# EAGLE design SprinklerControllerRecover (EAGLE 6.3)
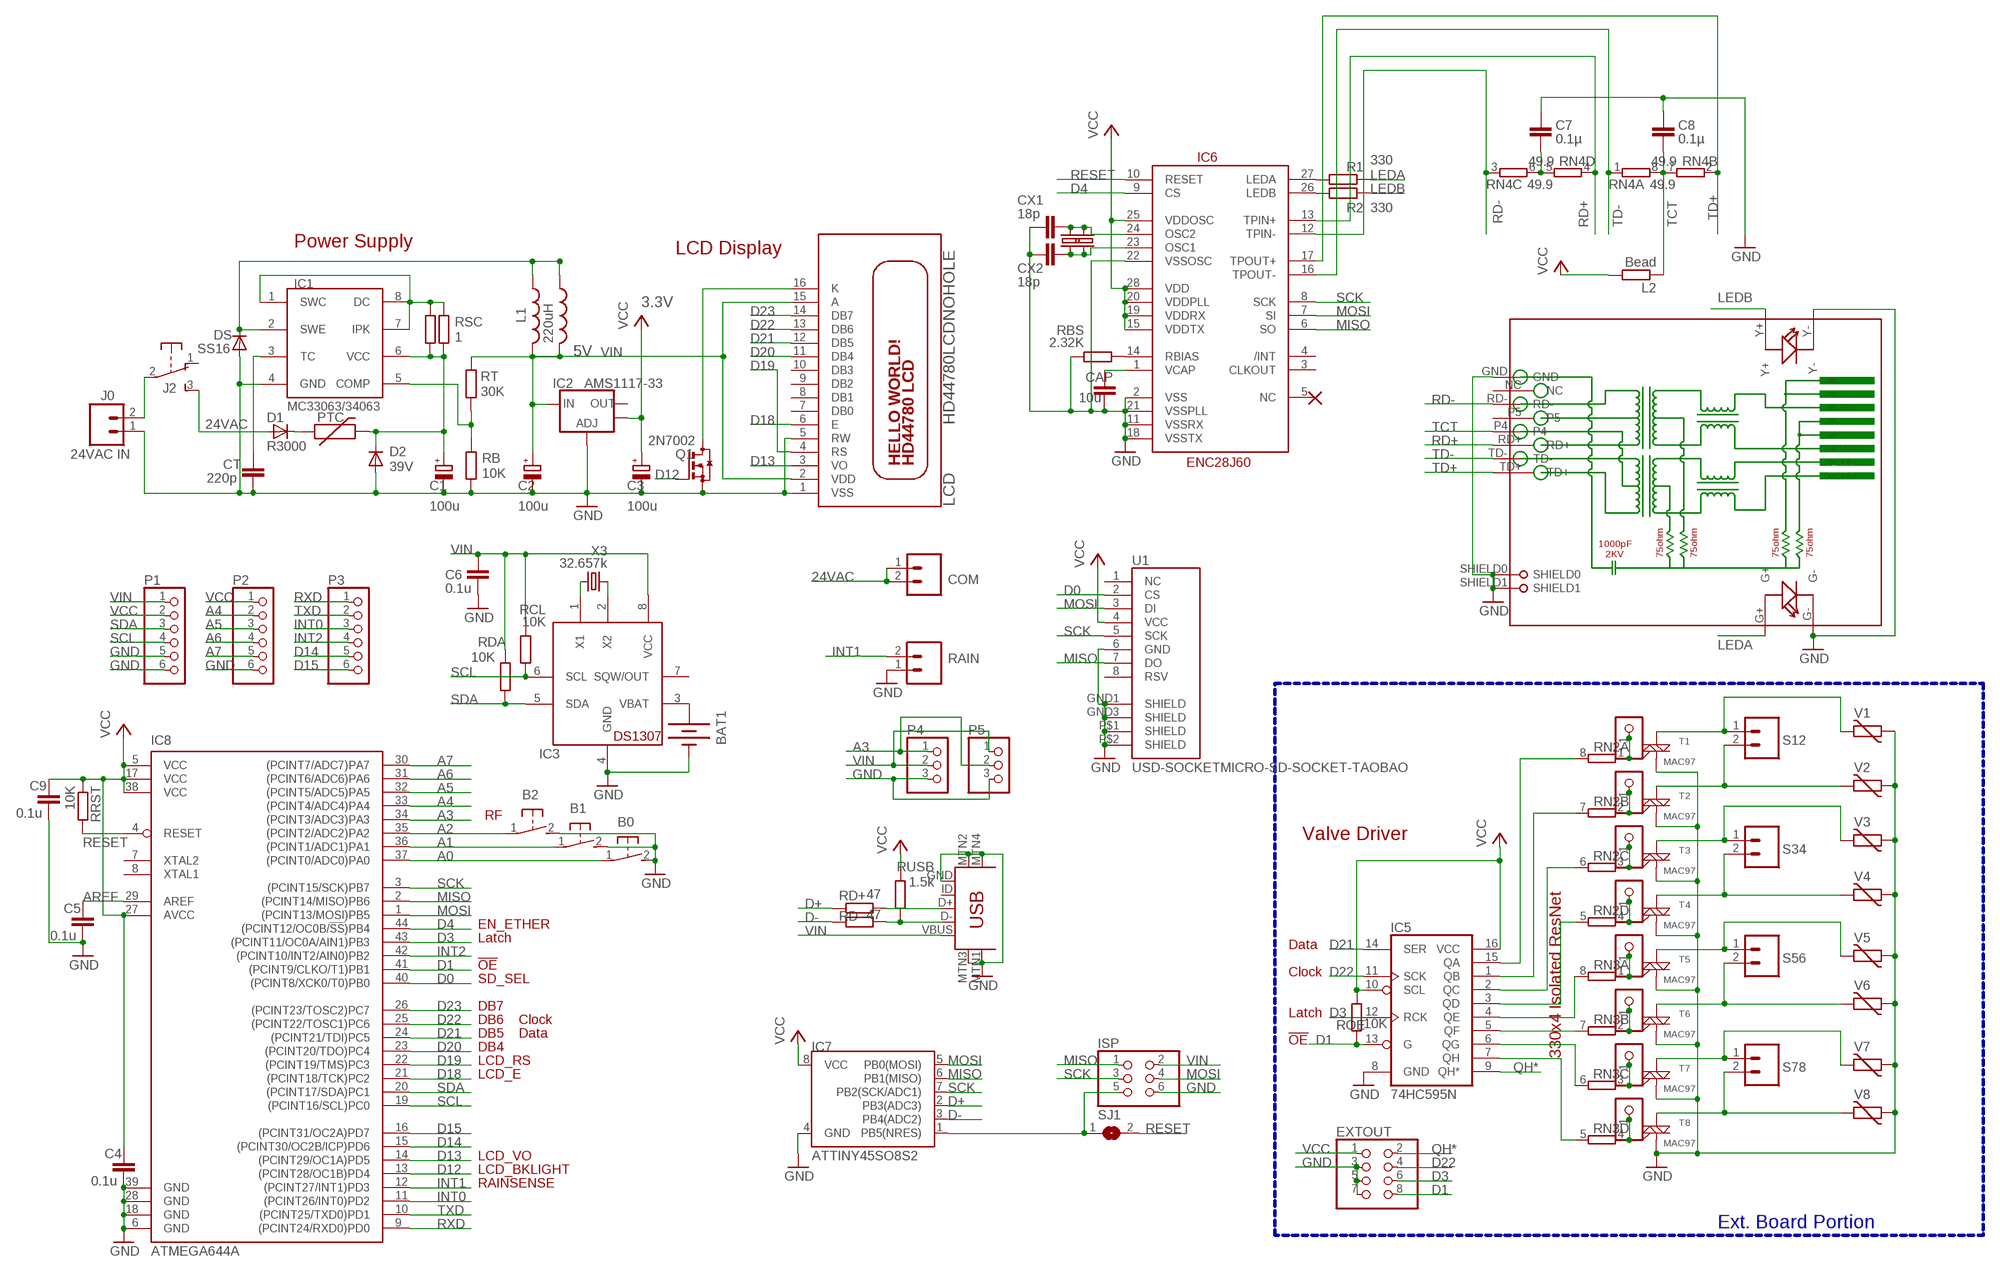
[diagram p0: schematic, sheet 1]

## Parts
B0  31-XX  [B3F-31XX]
B1  31-XX  [B3F-31XX]
B2  31-XX  [B3F-31XX]
BAT1  BATTERYBATTERY_12MM_SMT  [BATTCON_12MM_SMT]
C1  100u  CPOL-EUE3.5-8  [E3,5-8]
C2  100u  CPOL-EUE2.5-5  [E2,5-5]
C3  100u  CPOL-EUE2.5-5  [E2,5-5]
C4  0.1u  C-EUC0805  [C0805]
C5  0.1u  C-EUC0805  [C0805]
C6  0.1u  C-EUC0805  [C0805]
C7  0.1µ  C-EUC0805  [C0805]
C8  0.1µ  C-EUC0805  [C0805]
C9  0.1u  C-EUC0805  [C0805]
CAP  10u  C-EUC0805  [C0805]
COM  M025MM  [SCREWTERMINAL-5MM-2]
CT  220p  C-EUC0805  [C0805]
CX1  18p  C-EUC0805  [C0805]
CX2  18p  C-EUC0805  [C0805]
D1  R3000  DIODE-DO41-7.6  [DO41-7.6]
D2  39V  DIODE-DO41-7.6  [DO41-7.6]
DS  SS16  DIODE-DO214AC  [DO214AC]
EXTOUT  PINHD-2X4  [2X04]
IC1  MC34063  MC33063/MC34063D  [SO08]
IC2  AMS1117-33  V_REG_LM1117SOT223  [SOT223]
IC3  DS1307  DS1307SOIC  [SO08]
IC5  74HC595N  74LS595D  [SO16]
IC6  ENC28J60  ENC28J60SO28LONG  [SOIC28WLONG]
IC7  ATTINY45SO8S2  [SO8S2]
IC8  ATMEGA644A  [TQFP44]
ISP  PINHD-2X3  [2X03]
J0  24VAC IN  M025MM  [SCREWTERMINAL-5MM-2]
J2  EG1206  [EG1206]
JP2  PINHD-1X1CB  [1X01-CLEANBIG]
JP3  PINHD-1X1CB  [1X01-CLEANBIG]
JP4  PINHD-1X1CB  [1X01-CLEANBIG]
JP5  PINHD-1X1CB  [1X01-CLEANBIG]
JP6  PINHD-1X1CB  [1X01-CLEANBIG]
JP7  PINHD-1X1CB  [1X01-CLEANBIG]
JP8  PINHD-1X1CB  [1X01-CLEANBIG]
JP9  PINHD-1X1CB  [1X01-CLEANBIG]
L1  220uH  L-US6000-XXX-RC  [6000-XXXX-RC]
L2  Bead  R-EU_R0805  [R0805]
L3  220uH  INDUCTORSRU1038  [SRU1038]
LCD  HD44780LCDNOHOLE  [LCD1602A]
P1  PINHD-1X6CLEAN  [1X06-CLEAN]
P2  PINHD-1X6CLEAN  [1X06-CLEAN]
P3  PINHD-1X6CLEAN  [1X06-CLEAN]
P4  PINHD-1X3  [1X03]
P5  PINHD-1X3  [1X03]
PTC  PTC  PTCPTH  [PTC]
Q1  2N7002  BSS123  [SOT23]
R1  330  R-EU_R0805  [R0805]
R2  330  R-EU_R0805  [R0805]
RAIN  M025MM  [SCREWTERMINAL-5MM-2]
RB  10K  R-EU_R0805  [R0805]
RBS  2.32K  R-EU_R0805  [R0805]
RCL  10K  R-EU_R0805  [R0805]
RD+  47  R-EU_R0805  [R0805]
RD-  47  R-EU_R0805  [R0805]
RDA  10K  R-EU_R0805  [R0805]
RJ1  HR911105A  [HR911105A]
RN2  4R-NEXB38V  [EXB38V]
RN3  4R-NEXB38V  [EXB38V]
RN4  49.9  4R-NEXB38V  [EXB38V]
ROE  10K  R-EU_R0805  [R0805]
RRST  10K  R-EU_R0805  [R0805]
RSC  1  R-EU_R0805  [R0805]
RSC1  1.0  R-EU_R0805  [R0805]
RT  30K  R-EU_R0805  [R0805]
RUSB  1.5k  R-EU_R0805  [R0805]
S12  M025MM  [SCREWTERMINAL-5MM-2]
S34  M025MM  [SCREWTERMINAL-5MM-2]
S56  M025MM  [SCREWTERMINAL-5MM-2]
S78  M025MM  [SCREWTERMINAL-5MM-2]
SJ1  SJ  [SJ]
T1  MAC97  MAC97SOT223  [SOT223]
T2  MAC97  MAC97SOT223  [SOT223]
T3  MAC97  MAC97SOT223  [SOT223]
T4  MAC97  MAC97SOT223  [SOT223]
T5  MAC97  MAC97SOT223  [SOT223]
T6  MAC97  MAC97SOT223  [SOT223]
T7  MAC97  MAC97SOT223  [SOT223]
T8  MAC97  MAC97SOT223  [SOT223]
U1  USD-SOCKETMICRO-SD-SOCKET-TAOBAO  [MICRO-SD-SOCKET-TAOBAO]
U$1  USB-MINIB-5PIN  [USB-MINIB]
V1  MOV  VARISTOR-5  [R-5]
V2  MOV  VARISTOR-5  [R-5]
V3  MOV  VARISTOR-5  [R-5]
V4  MOV  VARISTOR-5  [R-5]
V5  MOV  VARISTOR-5  [R-5]
V6  MOV  VARISTOR-5  [R-5]
V7  MOV  VARISTOR-5  [R-5]
V8  MOV  VARISTOR-5  [R-5]
X2A  25MHz  CRYSTAL10.5X4.8  [CRYSTAL-SMD-10.5X4.8-2PIN]
X2A1  25MHz  CRYSTALHC49US  [HC49US]
X3  32.657k  CRYSTALTC26H  [TC26H]

## Nets
24VAC [power]: COM.1 COM.2 D1.A J2.3(S)
A0: B0.1(P) IC8.37((PCINT0/ADC0)PA0)
A1: B1.1(P) IC8.36((PCINT1/ADC1)PA1)
A2: B2.1(P) IC8.35((PCINT2/ADC2)PA2)
A3: IC8.34((PCINT3/ADC3)PA3) P4.1 P5.2
A4: IC8.33((PCINT4/ADC4)PA4) P2.2
A5: IC8.32((PCINT5/ADC5)PA5) P2.3
A6: IC8.31((PCINT6/ADC6)PA6) P2.4
A7: IC8.30((PCINT7/ADC7)PA7) P2.5
AREF: C5.1 IC8.29(AREF)
D0: IC8.40((PCINT8/XCK0/T0)PB0) U1.2(CS)
D1: EXTOUT.8 IC5.13(G) IC8.41((PCINT9/CLKO/T1)PB1) ROE.1
D3: EXTOUT.6 IC5.12(RCK) IC8.43((PCINT11/OC0A/AIN1)PB3)
D4: IC6.9(CS) IC8.44((PCINT12/OC0B/!SS!)PB4)
D12: IC8.13((PCINT28/OC1B)PD4) Q1.1(G)
D13: IC8.14((PCINT29/OC1A)PD5) LCD.3(VO)
D14: IC8.15((PCINT30/OC2B/ICP)PD6) P3.5
D15: IC8.16((PCINT31/OC2A)PD7) P3.6
D18: IC8.21((PCINT18/TCK)PC2) LCD.6(E)
D19: IC8.22((PCINT19/TMS)PC3) LCD.4(RS)
D20: IC8.23((PCINT20/TDO)PC4) LCD.11(DB4)
D21: IC5.14(SER) IC8.24((PCINT21/TDI)PC5) LCD.12(DB5)
D22: EXTOUT.4 IC5.11(SCK) IC8.25((PCINT22/TOSC1)PC6) LCD.13(DB6)
D23: IC8.26((PCINT23/TOSC2)PC7) LCD.14(DB7)
D+: IC7.2(PB3(ADC3)) RD+.1
D-: IC7.3(PB4(ADC2)) RD-.1
GND: B0.2(S) B1.2(S) B2.2(S) BAT1.P$1(-) C1.- C2.- C3.- C4.2 C5.2 C6.2 C7.1 C8.1 C9.2 CAP.2 CT.2 CX1.2 CX2.2 D2.A DS.A EXTOUT.3 EXTOUT.5 EXTOUT.7 IC1.4(GND) IC2.1(ADJ) IC3.4(GND) IC5.8(GND) IC6.2(VSS) IC6.11(VSSRX) IC6.18(VSSTX) IC6.21(VSSPLL) IC6.22(VSSOSC) IC7.4(GND) IC8.6(GND) IC8.18(GND) IC8.28(GND) IC8.39(GND) ISP.6 J0.1 LCD.1(VSS) LCD.5(RW) P1.5 P1.6 P2.6 P4.3 P5.3 Q1.2(S) RAIN.1 RB.2 RBS.1 RJ1.G- RJ1.GND RJ1.SHIELD0 RJ1.SHIELD1 RJ1.Y- T1.1(M1) T2.1(M1) T3.1(M1) T4.1(M1) T5.1(M1) T6.1(M1) T7.1(M1) T8.1(M1) U1.6(GND) U1.GND1(SHIELD) U1.GND3(SHIELD) U1.P$1(SHIELD) U1.P$2(SHIELD) U$1.GND U$1.MTN1(MTN2) U$1.MTN2(MTN3) U$1.MTN3(MTN1) U$1.MTN4 V1.1 V2.1 V3.1 V4.1 V5.1 V6.1 V7.1 V8.1
INT0: IC8.11((PCINT26/INT0)PD2) P3.3
INT1: IC8.12((PCINT27/INT1)PD3) RAIN.2
INT2: IC8.42((PCINT10/INT2/AIN0)PB2) P3.4
LEDA: R1.2 RJ1.G+
LEDB: R2.2 RJ1.Y+
MISO: IC6.6(SO) IC7.6(PB1(MISO)) IC8.2((PCINT14/MISO)PB6) ISP.1 U1.7(DO)
MOSI: IC6.7(SI) IC7.5(PB0(MOSI)) IC8.1((PCINT13/MOSI)PB5) ISP.4 U1.3(DI)
N$1: D1.C PTC.P$1
N$3: JP2.1 RN2.1 T1.3(G)
N$4: IC5.5(QF) RN3.7
N$5: IC5.6(QG) RN3.6
N$6 [power]: J0.2 J2.2(P)
N$7: IC5.7(QH) RN3.5
N$8 [power]: C1.+ D2.C IC1.6(VCC) PTC.P$2 RSC1.2 RSC.2
N$10: IC5.4(QE) RN3.8
N$11: IC5.3(QD) RN2.5
N$12: IC5.2(QC) RN2.6
N$13: IC5.1(QB) RN2.7
N$14: IC5.15(QA) RN2.8
N$15: JP3.1 RN2.2 T2.3(G)
N$16 [power]: S12.1 T1.4(M2) V1.2
N$17 [power]: S12.2 T2.4(M2) V2.2
N$18 [power]: S34.1 T3.4(M2) V3.2
N$19: JP4.1 RN2.3 T3.3(G)
N$20 [power]: S34.2 T4.4(M2) V4.2
N$21: JP5.1 RN2.4 T4.3(G)
N$22 [power]: S56.1 T5.4(M2) V5.2
N$23 [power]: S56.2 T6.4(M2) V6.2
N$24 [power]: S78.1 T7.4(M2) V7.2
N$25 [power]: S78.2 T8.4(M2) V8.2
N$26: JP6.1 RN3.1 T5.3(G)
N$27: JP7.1 RN3.2 T6.3(G)
N$28: JP8.1 RN3.3 T7.3(G)
N$29: JP9.1 RN3.4 T8.3(G)
N$34: IC6.27(LEDA) R1.1
N$36: BAT1.P$2(+) IC3.3(VBAT)
N$37: IC6.26(LEDB) R2.1
N$38: RD+.2 U$1.D+
N$39: CAP.1 IC6.1(VCAP)
N$40 [power]: IC1.1(SWC) IC1.7(IPK) IC1.8(DC) RSC1.1 RSC.1
N$41: CX1.1 IC6.24(OSC2) X2A1.2 X2A.P$2
N$42: CX2.1 IC6.23(OSC1) X2A1.1 X2A.P$1
N$45: RD-.2 RUSB.1 U$1.D-
N$46 [power]: DS.C IC1.2(SWE) L1.1 L3.1
N$47: IC3.1(X1) X3.1
N$49: CT.1 IC1.3(TC)
N$50: IC3.2(X2) X3.2
N$52: IC7.1(PB5(NRES)) ISP.5 SJ1.1
N$54: C7.2 RN4.5 RN4.6
N$55: IC1.5(COMP) RB.1 RT.2
N$56: LCD.16(K) Q1.3(D)
N$59: IC6.14(RBIAS) RBS.2
QH*: EXTOUT.2 IC5.9(QH*)
RD+: IC6.13(TPIN+) RJ1.RD+ RN4.4
RD-: IC6.12(TPIN-) RJ1.RD- RN4.3
RESET: IC6.10(RESET) IC8.4(RESET) RRST.2 SJ1.2
RXD: IC8.9((PCINT24/RXD0)PD0) P3.1
SCK: IC6.8(SCK) IC7.7(PB2(SCK/ADC1)) IC8.3((PCINT15/SCK)PB7) ISP.3 U1.5(SCK)
SCL: IC3.6(SCL) IC8.19((PCINT16/SCL)PC0) P1.4 RCL.2
SDA: IC3.5(SDA) IC8.20((PCINT17/SDA)PC1) P1.3 RDA.2
TCT: C8.2 L2.1 RJ1.P4 RN4.7 RN4.8
TD+: IC6.17(TPOUT+) RJ1.TD+ RN4.2
TD-: IC6.16(TPOUT-) RJ1.TD- RN4.1
TXD: IC8.10((PCINT25/TXD0)PD1) P3.2
VCC: C3.+ C4.1 C9.1 EXTOUT.1 IC2.4(OUT) IC5.10(SCL) IC5.16(VCC) IC6.15(VDDTX) IC6.19(VDDRX) IC6.20(VDDPLL) IC6.25(VDDOSC) IC6.28(VDD) IC7.8(VCC) IC8.5(VCC) IC8.17(VCC) IC8.27(AVCC) IC8.38(VCC) L2.2 P1.2 P2.1 ROE.2 RRST.1 RUSB.2 U1.4(VCC)
VIN: C2.+ C6.1 IC2.3(IN) IC3.8(VCC) ISP.2 L1.2 L3.2 LCD.2(VDD) LCD.15(A) P1.1 P4.2 P5.1 RCL.1 RDA.1 RT.1 U$1.VBUS
Unconnected: IC2.2(OUT) IC3.7(SQW/OUT) IC6.3(CLKOUT) IC6.4(/INT) IC6.5(NC) IC8.7(XTAL2) IC8.8(XTAL1) J2.1(O) LCD.7(DB0) LCD.8(DB1) LCD.9(DB2) LCD.10(DB3) RJ1.NC RJ1.P5 U1.1(NC) U1.8(RSV) U$1.ID

## Buses
B$1

## Notes on the sheet
- Power Supply
- LCD Display
- 3.3V
- 5V
- RF
- Valve Driver
- EN_ETHER
- Latch
- Data
- !OE
- Clock
- SD_SEL
- DB7
- Latch
- DB6 | Clock
- DB5 | Data
- !OE
- DB4
- 330x4 Isolated ResNet
- LCD_RS
- LCD_E
- LCD_VO
- LCD_BKLIGHT
- RAINSENSE
- Ext. Board Portion

## Library data of the parts
B0 B1 B2 = adafruit:31-XX: OMRON SWITCH Now with beefier pads!
BAT1 = SparkFunNew:BATTERY: Battery Holders Various common sizes : AA, AAA, 20mm coin cell and 12mm coin cell.
C1-C3 = resistor:CPOL-EU: POLARIZED CAPACITOR, European symbol
C4-C6 C9 CT = rcl:C-EU: CAPACITOR, European symbol
C7 C8 CAP CX1 CX2 = resistor:C-EU: CAPACITOR, European symbol
COM J0 RAIN S12 S34 S56 S78 = SparkFun:M02: Header 2 Standard 2-pin 0.1" header. Use with straight break away headers (SKU : PRT-00116), right angle break away headers (PRT-00553), swiss pins (PRT-00743), machine pins (PRT-00117), and female headers (PRT-00115). Molex polarized connector foot print use with SKU : PRT-08233 with associated crimp pins and housings.
D1 D2 DS = diode:DIODE-: DIODE
EXTOUT = pinhead:PINHD-2X4: PIN HEADER
IC1 = adafruit:MC33063/MC34063: MC33063 and MC34063 Basic DC/DC converter with internal power-NPN transistor, 100KHz, 1.5A peak switch current. 3-40 input/output.
IC2 = SparkFun:V_REG_LM1117: Voltage Regulator LM1117 Standard adjustable voltage regulator but in SMD form. Spark Fun Electronics SKU : COM-00595
IC3 = adafruit:DS1307: DS1307 Real time clock (RTC) with battery backup ability. Talk to it via i2c
IC5 = SparkFun:74*595: 8-bit SHIFT REGISTER, output latch
IC6 = SparkFun:ENC28J60
IC7 = SparkFun:ATTINY45: Atmel ATTiny45
IC8 = atmel:ATMEGA644: 8-bit Microcontroller with 64K Bytes In-System Programmable Flash Source: http://www.atmel.com/dyn/resources/prod_documents/doc2593.pdf; MPN: ATMEGA644PV-10AU; OC_FARNELL: 1455123; OC_NEWARK: 58M3748
ISP = pinhead:PINHD-2X3: PIN HEADER
J2 = adafruit:EG1206
JP2-JP9 = adafruit:PINHD-1X1: Pin header 1x1 for 0.1" spacing With round pins
L1 = rcl:L-US: INDUCTOR, American symbol
L2 R1 R2 RB RBS RCL RD+ RD- RDA ROE RRST RSC RSC1 RT RUSB = rcl:R-EU_: RESISTOR, European symbol
L3 = SparkFunNew:INDUCTOR: Inductors Basic Inductor/Choke - 0603 and 1206. Footprints are not proven and vary greatly between part numbers.
LCD = adafruit:HD44780LCD: HD44780 LCD Standard character type LCDs, available in sizes from 8x1 to 40x4!
P1-P3 = adafruit:PINHD-1X6: PIN HEADER
P4 P5 = pinhead:PINHD-1X3: PIN HEADER
PTC = SparkFunNew:PTC: Resettable Fuse PTC Resettable Fuse. Spark Fun Electronics SKU : COM-08357
Q1 = transistor-small-signal:BSS123: N-CHANNEL MOS FET
RJ1 = CONNECTER:HR911105A
RN2-RN4 = resistor-dil:4R-N: Array Chip Resistor Source: RS Component / Phycomp; OC_FARNELL: unknown; OC_NEWARK: unknown
SJ1 = jumper:SJ: SMD solder JUMPER
T1-T8 = SparkFun:MAC97: MAC97 Triac http://www.onsemi.com/pub_link/Collateral/MAC97-D.PDF
U1 = SparkFunNew:USD-SOCKET: microSD Socket Push-push type uSD socket. Schematic element and footprint production proven. Spark Fun Electronics SKU : PRT-00127. tDoc lines correctly indicate media card edge positions when inserting (unlocked, locked, depressed).
U$1 = SparkFunNew:USB-MINIB: Mini-USB "B" connector with 5th pin broken out. Created new symbol breaking out 5th "ID" pin in mini/micro USB connector spec. See: http://en.wikipedia.org/wiki/Mini_usb#Cables. Uses same footprint as 4-pin symbol. Also added pins to connect to mounting / shield pads if required (probably not generally needed as signals aren't shielded once they leave the connector).
V1-V8 = varistor:VARISTOR: VARISTOR
X2A X2A1 = SparkFun:CRYSTAL: Crystals Various standard crystals. Proven footprints. Spark Fun Electronics SKU : COM-00534
X3 = crystal:CRYSTAL: CRYSTAL; OC_FARNELL: unknown; OC_NEWARK: unknown

## Net classes
0 default: width 0.305 mm, clearance 0.203 mm
1 power: width 0.813 mm, clearance 0.203 mm

## Board
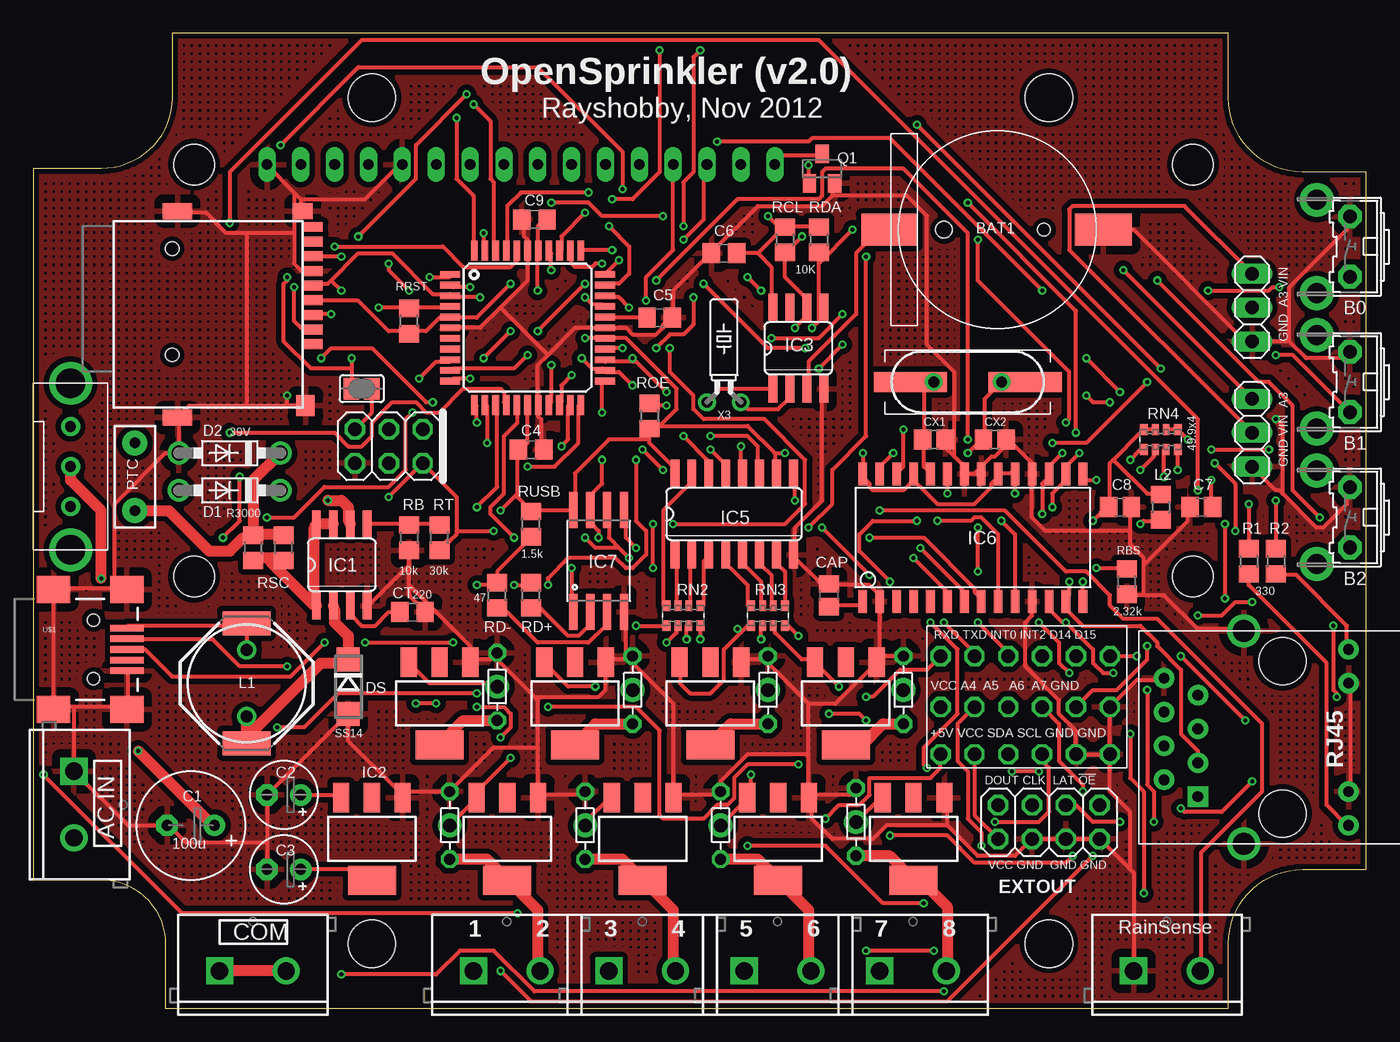
[diagram p1: board, top side]
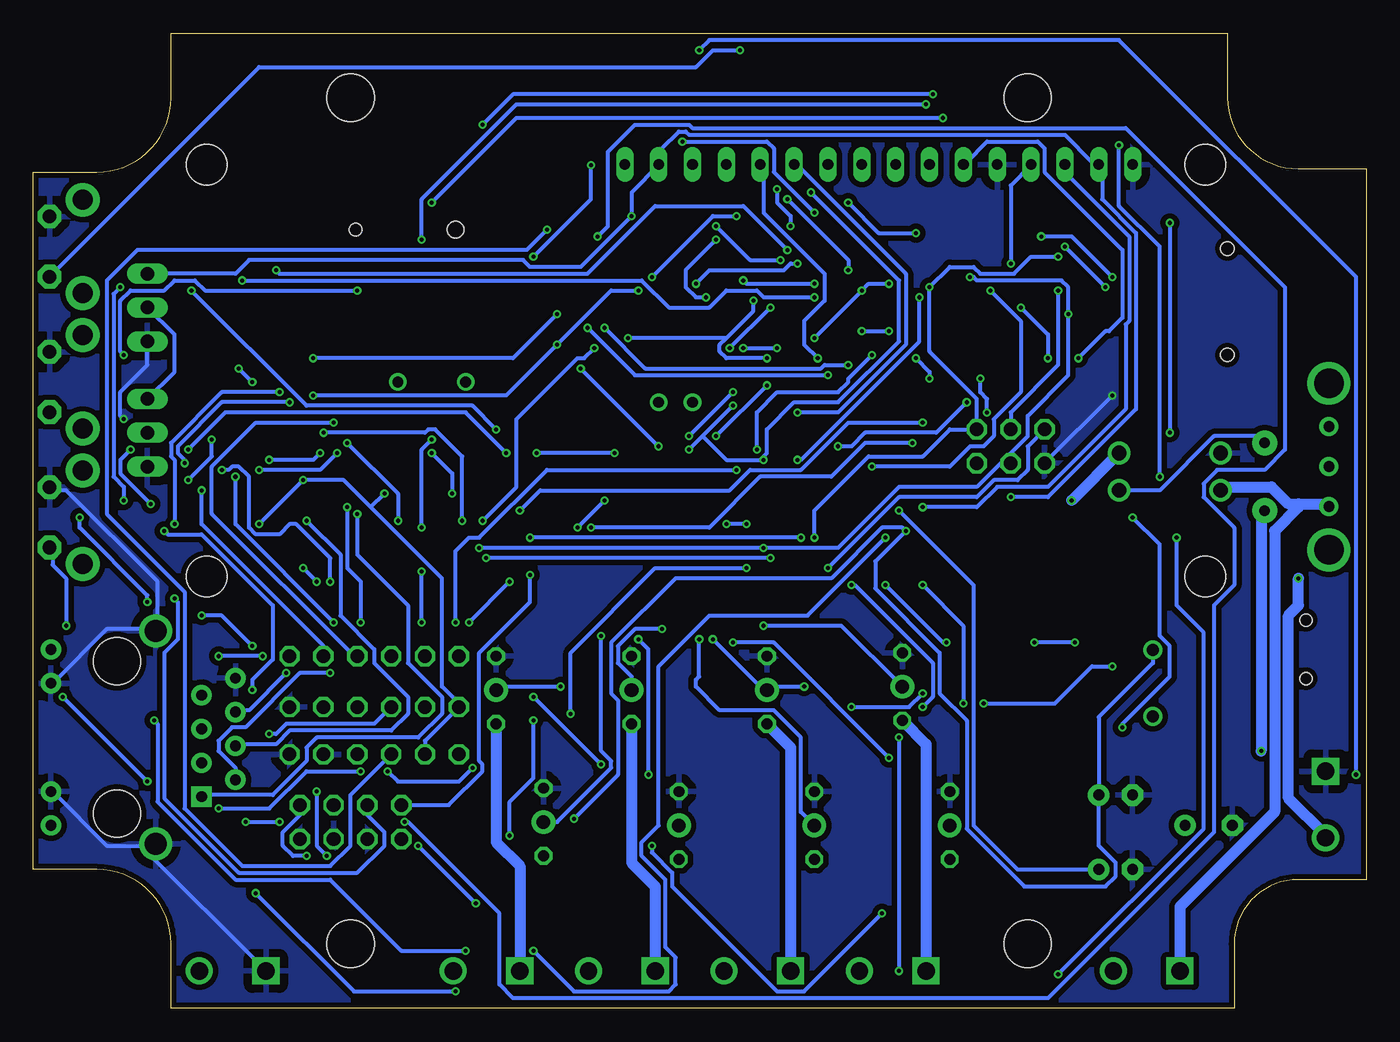
[diagram p2: board, bottom side, seen from below]

Size 100 x 73.15 mm. Coordinates in mm from the lower left corner, seen from the top.
Outline: 9.91,0 89.66,0 89.66,4.83 arc-90 95.25,10.41 100,10.41 100,62.74 95.25,62.74 arc-90 89.66,68.33 89.66,73.15 10.41,73.15 10.41,68.33 arc-90 5.08,62.99 0,62.99 0,9.65 5.08,9.65 arc-90 9.91,4.83 9.91,0
Copper layers (1*16): Top 0.035mm / dielectric 1.5mm / Bottom 0.035mm
Design rules "default": minimum track width 6mil, minimum drill 12mil, track to track 6mil, track to pad 6mil, pad to pad 8mil, via to via 8mil, smd to smd 0mil, copper to edge 10mil, drill to drill 10mil, minimum pad ring 10mil, minimum via ring 6mil, stop-mask expansion 2mil, vias tented up to drill 100mil, thermal gap 25mil
Holes 3.56 mm at 25.4,4.83 76.2,4.83 25.4,68.33 76.2,68.33
Holes 3.05 mm at 12.06,32.38 12.06,63.3 87,63.3 87,32.38
vRestrict: area 22.9,2.3 to 27.9,7.4; area 73.7,2.3 to 78.7,7.4; area 71.9,10.4 to 81.3,10.9; area 71.4,16.8 to 80.8,17.3; area 4.6,12.4 to 6.6,18.3; area 14,4.8 to 19.1,6.6; area 72.4,8.6 to 78,9.7; area 81.5,5.6 to 89.4,6.6; area 67.3,20.3 to 81.8,21.1; area 67.3,23.9 to 81.8,24.6; area 67.3,27.7 to 81.8,28.4; area 9.5,29.8 to 14.6,34.9; 4 more areas

### Footprints (pad centres in the part's own frame; a part is rotated, then mirrored left to right if it is on the bottom)
B3F-31XX = drill 1.016 pad 1.778 octagon: 1 -2.261,-1.245; 2 2.261,-1.245 | drill 1.499 pad 2.54: 3 -3.505,1.245; 4 3.505,1.245
BATTCON_12MM_SMT = smd 2.4 x 4.3: P$1 0,11.96 | smd 2.4 x 4.2: P$2 0,-4.1 | hole 0.95: 0,7.5 | hole 1.25: 0,0
E3,5-8 = drill 0.813 pad 1.6: + -1.778,0 | drill 0.813 pad 1.6 octagon: - 1.778,0
E2,5-5 = drill 0.813 pad 1.6: + -1.27,0 | drill 0.813 pad 1.6 octagon: - 1.27,0
C0805 = smd 1.3 x 1.5: 1 -0.95,0; 2 0.95,0
C0805' = smd 1.3 x 1.5: 1 -0.85,0; 2 0.85,0
SCREWTERMINAL-5MM-2 = drill 1.3 pad 2.032 square: 1 0,0 | drill 1.3 pad 2.032: 2 5,0
DO41-7.6 = drill 1.1 pad 1.7: A 3.81,0; C -3.81,0
DO214AC = smd 1.8 x 1.7: A 2.05,0; C -2.05,0
2X04 = drill 1.016 octagon: 1 -3.81,-1.27; 2 -3.81,1.27; 3 -1.27,-1.27; 4 -1.27,1.27; 5 1.27,-1.27; 6 1.27,1.27; 7 3.81,-1.27; 8 3.81,1.27
SO08 = smd 0.66 x 2.032: 1 -1.905,-3.073; 2 -0.635,-3.073; 3 0.635,-3.073; 4 1.905,-3.073; 5 1.905,3.073; 6 0.635,3.073; 7 -0.635,3.073; 8 -1.905,3.073
SOT223 = smd 1.219 x 2.235: 1 -2.311,-3.099; 2 0,-3.099; 3 2.311,-3.099 | smd 3.6 x 2.2: 4 0,3.099
SO16 = smd 0.66 x 2.032: 1 -4.445,-3.073; 2 -3.175,-3.073; 3 -1.905,-3.073; 4 -0.635,-3.073; 5 0.635,-3.073; 6 1.905,-3.073; 7 3.175,-3.073; 8 4.445,-3.073; 9 4.445,3.073; 10 3.175,3.073; 11 1.905,3.073; 12 0.635,3.073; 13 -0.635,3.073; 14 -1.905,3.073; 15 -3.175,3.073; 16 -4.445,3.073
SOIC28WLONG = smd 0.65 x 1.7: 1 -8.89,-4.78; 2 -7.62,-4.78; 3 -6.35,-4.78; 4 -5.08,-4.78; 5 -3.81,-4.78; 6 -2.54,-4.78; 7 -1.27,-4.78; 8 0,-4.78; 9 1.27,-4.78; 10 2.54,-4.78; 11 3.81,-4.78; 12 5.08,-4.78; 13 6.35,-4.78; 14 7.62,-4.78; 15 7.62,4.78; 16 6.35,4.78; 17 5.08,4.78; 18 3.81,4.78; 19 2.54,4.78; 20 1.27,4.78; 21 0,4.78; 22 -1.27,4.78; 23 -2.54,4.78; 24 -3.81,4.78; 25 -5.08,4.78; 26 -6.35,4.78; 27 -7.62,4.78; 28 -8.89,4.78
SO8S2 = smd 0.61 x 2.7: 1 -1.905,-3.778; 2 -0.635,-3.778; 3 0.635,-3.778; 4 1.905,-3.778; 5 1.905,3.853; 6 0.635,3.853; 7 -0.635,3.853; 8 -1.905,3.853
TQFP44 = smd 1.5 x 0.5: 1 -5.8,4; 2 -5.8,3.2; 3 -5.8,2.4; 4 -5.8,1.6; 5 -5.8,0.8; 6 -5.8,0; 7 -5.8,-0.8; 8 -5.8,-1.6; 9 -5.8,-2.4; 10 -5.8,-3.2; 11 -5.8,-4; 23 5.8,-4; 24 5.8,-3.2; 25 5.8,-2.4; 26 5.8,-1.6; 27 5.8,-0.8; 28 5.8,0; 29 5.8,0.8; 30 5.8,1.6; 31 5.8,2.4; 32 5.8,3.2; 33 5.8,4 | smd 0.5 x 1.5: 12 -4,-5.8; 13 -3.2,-5.8; 14 -2.4,-5.8; 15 -1.6,-5.8; 16 -0.8,-5.8; 17 0,-5.8; 18 0.8,-5.8; 19 1.6,-5.8; 20 2.4,-5.8; 21 3.2,-5.8; 22 4,-5.8; 34 4,5.8; 35 3.2,5.8; 36 2.4,5.8; 37 1.6,5.8; 38 0.8,5.8; 39 0,5.8; 40 -0.8,5.8; 41 -1.6,5.8; 42 -2.4,5.8; 43 -3.2,5.8; 44 -4,5.8
2X03 = drill 1.016 octagon: 1 -2.54,-1.27; 2 -2.54,1.27; 3 0,-1.27; 4 0,1.27; 5 2.54,-1.27; 6 2.54,1.27
EG1206 = drill 0.8 pad 1.422: 1 -3,0; 2 0,0; 3 3,0 | drill 2.2: MT1 -6.25,0; MT2 6.25,0
1X01-CLEANBIG = drill 1.016 pad 1.778: 1 0,0
6000-XXXX-RC = drill 0.9 pad 1.422: 1 -2.5,0; 2 2.5,0
R0805 = smd 1.3 x 1.5: 1 -0.95,0; 2 0.95,0
SRU1038 = smd 1.8 x 3.6: 1 -4.5,0; 2 4.5,0
LCD1602A = drill 0.8 long: 1 8,33.46; 2 10.54,33.46; 3 13.08,33.46; 4 15.62,33.46; 5 18.16,33.46; 6 20.7,33.46; 7 23.24,33.46; 8 25.78,33.46; 9 28.32,33.46; 10 30.86,33.46; 11 33.4,33.46; 12 35.94,33.46; 13 38.48,33.46; 14 41.02,33.46; 15 43.56,33.46; 16 46.1,33.46
1X06-CLEAN = drill 1.016 octagon: 1 -6.35,0; 2 -3.81,0; 3 -1.27,0; 4 1.27,0; 5 3.81,0; 6 6.35,0
1X03 = drill 1.016 long: 1 -2.54,0; 2 0,0; 3 2.54,0
PTC = drill 0.8 pad 1.88: P$1 -2.54,0; P$2 2.54,0
SOT23 = smd 1 x 1.4: 1 -0.95,-1.1; 2 0.95,-1.1; 3 0,1.1
HR911105A = drill 0.813 pad 1.524: G+ 4.953,-6.604; G- 4.953,-4.064; GND -8.89,4.445; NC -6.35,3.175; P4 -8.89,-0.635; P5 -6.35,0.635; RD+ -6.35,-1.905; RD- -8.89,1.905; TD- -8.89,-3.175; Y+ 4.953,6.604; Y- 4.953,4.064 | drill 1.651 pad 2.159: SHIELD0 -2.921,8.001; SHIELD1 -2.921,-8.001 | drill 0.813 pad 1.524 square: TD+ -6.35,-4.445 | hole 3.556: 0,-5.715; 0,5.715
EXB38V = smd 0.6 x 0.8: 1 -1.275,-0.75; 4 1.275,-0.75; 5 1.275,0.75; 8 -1.275,0.75 | smd 0.5 x 0.8: 2 -0.4,-0.75; 3 0.4,-0.75; 6 0.4,0.75; 7 -0.4,0.75
SJ = smd 1.168 x 1.6: 1 -0.762,0; 2 0.762,0
MICRO-SD-SOCKET-TAOBAO = smd 0.75 x 1.6: 1 2.25,10.5; 2 1.15,10.5; 3 0.05,10.5; 4 -1.05,10.5; 5 -2.15,10.5; 6 -3.25,10.5; 7 -4.35,10.5; 8 -5.45,10.5 | smd 0.7 x 1.6: CD -6.55,10.5 | smd 1.2 x 1.5: GND1 -7.75,9.8 | smd 1.6 x 1.4: GND3 6.85,10 | smd 1.2 x 2.2: P$1 7.75,0.4; P$2 -7.75,0.4 | hole 1: 3.05,0; -4.93,0
USB-MINIB = smd 2.5 x 0.5: D+ 2.5,0; D- 2.5,0.8; GND 2.5,-1.6; ID 2.5,-0.8; VBUS 2.5,1.6 | smd 2.5 x 2: MTN1 -3,4.5; MTN2 2.5,4.5; MTN3 -3,-4.5; MTN4 2.5,-4.5 | hole 0.9: 0,2.2; 0,-2.2
R-5 = drill 0.813 octagon: 1 -2.54,0; 2 2.54,0
CRYSTAL-SMD-10.5X4.8-2PIN = smd 5.5 x 1.5: P$1 -4.3,0; P$2 4.3,0
HC49US = drill 0.813: 1 -2.54,0; 2 2.54,0
TC26H = drill 0.813: 1 -1.27,0; 2 1.27,0

### Placement (x,y rotation side)
B0  97.54,57.15 90 top
B1  97.54,46.99 90 top
B2  97.54,36.83 90 top
BAT1  68.33,58.42 270 top
C1  11.81,13.72 180 top
C2  18.8,16 180 top
C3  18.8,10.41 180 top
C4  37.34,41.91 0 top
C5  46.99,51.82 0 top
C6  51.82,56.64 180 top
C7  0.1µ  [C0805']  87.63,37.59 0 top
C8  0.1µ  [C0805']  81.53,37.59 180 top
C9  37.59,59.18 180 top
CAP  10u  [C0805']  59.69,30.99 90 top
COM  13.97,2.79 0 top
CT  28.45,29.72 0 top
CX1  18p  [C0805']  67.56,42.67 0 top
CX2  18p  [C0805']  72.14,42.67 0 top
D1  14.73,38.86 180 top
D2  14.73,41.66 180 top
DS  23.62,24.13 270 top
EXTOUT  76.2,13.97 0 top
IC1  23.15,33.27 0 top
IC2  25.4,12.7 180 top
IC3  57.4,49.53 0 top
IC5  52.58,37.08 0 top
IC6  71.12,35.31 0 top
IC7  42.42,33.53 0 top
IC8  37.08,51.05 0 top
ISP  26.67,42.16 180 top
J0  3.05,17.78 270 top
J2  2.79,40.64 270 top
JP2  34.8,24.13 0 top
JP3  31.24,13.72 0 top
JP4  44.96,23.88 0 top
JP5  41.4,13.72 0 top
JP6  55.12,23.88 0 top
JP7  51.56,13.72 0 top
JP8  65.28,23.88 0 top
JP9  61.72,13.97 0 top
L1  16,24.38 90 top
L2  84.58,37.59 270 top
L3  16,24.38 90 top
LCD  9.53,29.84 0 top
P1  74.42,19.05 0 top
P2  74.42,22.61 0 top
P3  74.42,26.42 0 top
P4  91.44,43.18 270 top
P5  91.44,52.58 270 top
PTC  7.62,39.88 270 top
Q1  59.18,62.99 0 top
R1  91.19,33.53 270 top
R2  93.22,33.53 270 top
RAIN  82.55,2.79 0 top
RB  28.19,35.31 270 top
RBS  82.04,32 90 top
RCL  56.39,57.66 270 top
RD+  37.34,30.99 90 top
RD-  34.8,30.99 90 top
RDA  58.93,57.66 270 top
RJ1  93.73,20.32 0 top
RN2  48.77,29.46 0 top
RN3  55.12,29.46 0 top
RN4  84.58,42.67 0 top
ROE  46.23,44.45 270 top
RRST  28.19,51.56 90 top
RSC  16.51,34.54 90 top
RSC1  18.8,34.54 90 top
RT  30.48,35.31 90 top
RUSB  37.34,36.32 90 top
S12  33.02,2.79 0 top
S34  43.18,2.79 0 top
S56  53.34,2.79 0 top
S78  63.5,2.79 0 top
SJ1  24.64,46.48 180 top
T1  30.48,22.86 180 top
T2  35.56,12.7 180 top
T3  40.64,22.86 180 top
T4  45.72,12.7 180 top
T5  50.8,22.86 180 top
T6  55.88,12.7 180 top
T7  60.96,22.86 180 top
T8  66.04,12.7 180 top
U1  10.41,52.07 270 top
U$1  4.52,26.92 0 top
V1  34.8,24.13 270 top
V2  31.24,13.72 270 top
V3  44.96,23.88 270 top
V4  41.4,13.72 270 top
V5  55.12,23.88 270 top
V6  51.56,13.72 270 top
V7  65.28,23.88 270 top
V8  61.72,13.97 270 top
X2A  70.1,46.99 180 top
X2A1  70.1,46.99 180 top
X3  51.82,45.47 0 top

### Tracks (layer width: path | path; a pad name or v marks a point on that pad's centre or on a via)
24VAC
  Top 0.813: COM.2 COM.1
  Bottom 0.813: 5.08,37.85 5.84,37.85 7.11,39.12 10.67,39.12 D1.A | 5.08,37.85 2.79,37.85 J2.3 | COM.1 13.97,7.62 6.86,14.73 6.86,35.81 5.08,37.59 5.08,37.85
A0  (via drill 0.3)
  Top 0.305: v38.86,55.37 38.86,56.64 IC8.37 | v43.43,60.71 44.96,60.71 46.99,62.74 v46.99,71.88
  Bottom 0.305: v38.86,55.37 38.86,56.13 v43.43,60.71 | v46.99,71.88 49.02,71.88 50.29,70.61 83.06,70.61 B0.1
A1  (via drill 0.3)
  Top 0.305: v41.4,59.69 39.62,57.91 39.62,56.9 IC8.36 | v51.31,65.02 58.17,65.02 58.42,65.28 64.26,65.28 v75.69,53.85 | v93.22,49.02 94.49,49.02 B1.1
  Bottom 0.305: v41.4,59.69 44.45,62.74 44.45,64.52 44.96,65.02 v51.31,65.02 | v75.69,53.85 87.12,53.85 87.88,54.61 89.41,54.61 90.17,53.85 92.71,53.85 93.47,53.09 93.47,49.28 v93.22,49.02
A2  (via drill 0.3)
  Top 0.305: v42.67,55.88 42.16,55.88 41.91,55.63 40.64,55.63 40.39,55.88 40.39,56.64 IC8.35 | v50.29,54.36 55.12,49.53 v57.91,49.53 | v66.29,36.58 62.99,36.58 61.98,35.56 61.98,34.29 v64.26,32 | v67.31,28.96 69.34,26.92 69.34,22.1 66.8,19.56 66.8,18.29 v67.06,18.03 | v75.44,17.78 v73.41,17.78 | v86.11,14.99 86.36,14.73 89.15,14.73 v91.44,17.02 | v97.79,23.37 97.79,23.62 97.54,23.88 v97.54,28.7
  Bottom 0.305: v42.67,55.88 43.18,55.88 43.69,55.37 49.28,55.37 v50.29,54.36 | v57.91,49.53 58.67,48.77 59.18,48.77 63.75,44.2 63.75,39.12 v66.29,36.58 | v67.31,28.96 v64.26,32 | v67.06,18.03 68.07,17.02 72.64,17.02 v73.41,17.78 | v75.44,17.78 79.5,17.78 82.3,14.99 v86.11,14.99 | v97.79,23.37 v91.44,17.02 | v97.54,28.7 97.54,32.26 98.55,33.27 98.55,34.54 B2.1
A3  (via drill 0.3)
  Top 0.305: v43.43,56.9 41.15,56.9 IC8.34 | P4.1 v81.79,55.37
  Bottom 0.305: v43.43,56.9 46.74,60.2 53.34,60.2 58.42,55.12 81.53,55.12 v81.79,55.37 | P5.2 89.41,50.55 89.41,47.75 P4.1
A4  (via drill 0.3)
  Top 0.305: v43.94,56.13 42.93,55.12 IC8.33 | v48.77,58.67 48.77,61.98 49.53,62.74 49.53,71.37 v50.04,71.88 | v0.76,17.53 11.18,7.11 v36.32,7.11 | v53.59,12.19 59.44,12.19 63.75,7.87 v66.8,7.87 | v71.12,12.19 71.12,13.21 70.1,14.22 70.1,17.78 69.34,18.54 69.34,21.34 P2.2
  Bottom 0.305: v43.94,56.13 46.23,56.13 v48.77,58.67 | v50.04,71.88 49.28,72.64 18.54,72.64 0.76,54.86 v0.76,17.53 | v36.32,7.11 42.16,1.27 44.2,1.27 52.07,9.14 52.07,10.16 53.59,11.68 v53.59,12.19 | v71.12,12.19 v66.8,7.87
A5  (via drill 0.3)
  Top 0.305: v43.18,58.67 44.7,57.15 44.7,55.12 43.94,54.36 42.93,54.36 IC8.32 | v44.2,61.47 44.2,64.26 37.85,70.61 24.38,70.61 v18.54,64.77 | v15.49,39.88 15.49,36.58 v14.22,35.31 | v23.11,2.54 30.23,2.54 32,4.32 34.54,4.32 37.59,1.27 v68.33,1.27 | v83.31,8.64 83.31,16.26 82.3,17.27 v82.3,20.57
  Bottom 0.305: v43.18,58.67 43.18,59.44 44.2,60.45 v44.2,61.47 | v18.54,64.77 18.54,60.2 15.49,57.15 v15.49,39.88 | v14.22,35.31 14.22,30.23 12.19,28.19 12.19,13.46 v23.11,2.54 | v68.33,1.27 75.95,1.27 v83.31,8.64 | v82.3,20.57 81.79,20.57 81.03,21.34 74.42,21.34 P2.3
A6  (via drill 0.3)
  Top 0.305: v44.7,52.58 43.94,53.34 42.93,53.34 IC8.31 | v47.75,49.53 47.75,47.75 49.53,45.97 49.53,44.96 50.29,44.2 54.86,44.2 57.91,41.15 57.91,37.85 56.39,36.32 v48.01,36.32 | v46.48,33.02 v46.48,36.32 | v59.69,22.1 61.98,22.1 v62.48,21.59 | v64.26,12.95 68.58,12.95 70.61,10.92 77.47,10.92 v77.98,11.43 | v78.74,16.26 78.74,16.76 76.96,18.54 76.96,21.34 P2.4
  Bottom 0.305: v47.75,49.53 v44.7,52.58 | v46.48,36.32 v48.01,36.32 | v46.48,33.02 53.34,33.02 59.69,26.67 v59.69,22.1 | v62.48,21.59 62.48,17.27 64.26,15.49 v64.26,12.95 | v77.98,11.43 78.74,12.19 v78.74,16.26
A7  (via drill 0.3)
  Top 0.305: v41.4,53.34 41.91,52.83 42.67,52.83 IC8.30 | v84.33,54.61 91.95,46.99 92.71,46.99 94.49,45.21 94.49,38.86 v96.52,36.83 | v91.44,30.48 90.17,30.48 89.15,29.46 v87.38,29.46 | v83.57,27.18 83.57,26.16 81.28,23.88 79.5,23.88 P2.5
  Bottom 0.305: v41.4,53.34 45.21,53.34 45.72,53.85 48.01,53.85 49.28,52.58 52.32,52.58 54.36,54.61 v84.33,54.61 | v96.52,36.83 96.52,36.07 91.44,30.99 v91.44,30.48 | v87.38,29.46 85.85,29.46 v83.57,27.18
AREF
  Top 0.305: C5.1 42.93,51.82 IC8.29
D0  (via drill 0.3)
  Top 0.305: v22.61,57.15 30.73,57.15 32.26,55.63 35.81,55.63 36.32,56.13 36.32,56.64 IC8.40 | v19.56,54.1 19.56,51.56 20.07,51.05 20.83,51.05 U1.2
  Bottom 0.305: v19.56,54.1 v22.61,57.15
D1  (via drill 0.3)
  Top 0.305: v47.5,45.21 46.23,45.21 ROE.1 | v50.8,41.91 51.82,40.89 51.82,40.39 IC5.13 | v41.66,61.21 36.58,61.21 35.56,60.2 35.56,56.9 IC8.41 | v79.5,11.43 68.58,0.51 37.34,0.51 v35.05,2.79 | v35.05,20.32 35.81,21.08 35.81,22.1 35.31,22.61 v33.27,22.61 | v38.61,31.75 38.61,32.26 40.13,33.78 43.69,33.78 44.45,33.02 44.96,33.02 45.97,34.04 45.97,35.81 45.21,36.58 v45.21,41.15
  Bottom 0.305: v50.8,41.91 49.78,42.93 | 49.78,42.93 v47.5,45.21 | v41.66,61.21 35.05,54.61 35.05,50.04 39.62,45.47 42.93,45.47 44.96,43.43 44.96,41.66 45.21,41.4 | 45.21,41.4 45.47,41.15 48.01,41.15 49.78,42.93 | EXTOUT.8 80.01,14.48 81.28,13.21 81.28,12.19 80.52,11.43 v79.5,11.43 | v35.05,20.32 v35.05,2.79 | v33.27,22.61 32.51,23.37 32.51,25.91 38.35,31.75 v38.61,31.75 | 45.21,41.4 v45.21,41.15
D3  (via drill 0.3)
  Top 0.305: v33.78,58.17 33.78,56.9 IC8.43 | v38.86,60.45 41.66,60.45 42.67,59.44 v47.24,59.44 | v54.61,53.85 v53.59,54.86 | v58.93,48.01 v60.71,49.78 | v53.09,42.16 53.09,40.39 IC5.12 | EXTOUT.6 78.23,15.24 79.5,13.97 v81.53,13.97 | v84.07,13.97 84.07,16.26 83.57,16.76 v83.57,23.88 | v90.17,35.81 90.17,39.37 v88.65,40.89 | v80.77,45.47 79.5,45.47 v78.99,45.97
  Bottom 0.305: v33.78,58.17 36.58,58.17 v38.86,60.45 | v47.24,59.44 49.02,59.44 v53.59,54.86 | v54.61,53.85 56.64,53.85 v60.71,49.78 64.52,45.97 v78.99,45.97 | v53.09,42.16 v58.93,48.01 | v84.07,13.97 v81.53,13.97 | v83.57,23.88 83.57,24.64 82.04,26.16 82.04,30.23 87.38,35.56 89.92,35.56 v90.17,35.81 | v88.65,40.89 88.65,41.15 89.15,41.66 89.15,42.16 85.85,45.47 v80.77,45.47
D4  (via drill 0.3)
  Top 0.305: v31.75,66.8 31.75,62.23 33.02,60.96 33.02,56.9 IC8.44 | v70.1,60.45 78.23,52.32 v78.23,43.18 | v67.82,36.58 70.36,36.58 70.61,36.83 71.12,36.83 72.39,35.56 IC6.9
  Bottom 0.305: v31.75,66.8 63.75,66.8 v70.1,60.45 | v78.23,43.18 70.61,43.18 70.36,43.43 69.85,43.43 67.82,41.4 v67.82,36.58
D12  (via drill 0.3)
  Top 0.305: v58.17,63.25 58.17,61.98 Q1.1 | v62.48,56.39 62.48,42.93 59.94,40.39 59.94,37.85 v58.17,36.07 | v34.04,42.42 34.04,45.21 IC8.13
  Bottom 0.305: v58.17,63.25 58.17,60.71 v62.48,56.39 | v58.17,36.07 49.28,36.07 45.47,39.88 40.13,39.88 37.59,42.42 v34.04,42.42
D13  (via drill 0.3)
  Top 0.305: v33.27,37.59 34.8,39.12 34.8,45.21 IC8.14
  Bottom 0.305: v33.27,37.59 29.21,37.59 27.69,39.12 23.88,39.12 18.03,44.96 18.03,51.31 17.78,51.56 17.78,57.91 22.35,62.48 22.35,63.25 LCD.3
D14  (via drill 0.3)
  Top 0.305: v14.73,43.18 22.61,43.18 23.62,42.16 24.64,42.16 25.4,42.93 25.4,43.94 26.92,45.47 28.7,45.47 29.46,44.7 30.48,44.7 32.26,46.48 35.05,46.48 35.31,46.23 35.31,45.47 IC8.15 | v14.73,58.93 14.73,62.74 24.64,72.64 58.93,72.64 87.38,44.2 v87.38,38.86
  Bottom 0.305: v14.73,58.93 v14.73,43.18 | v87.38,38.86 87.38,36.32 78.23,27.18 P3.5
D15  (via drill 0.3)
  Top 0.305: v36.07,35.31 34.29,37.08 34.29,37.59 35.31,38.61 35.31,42.93 36.32,43.94 36.32,45.21 IC8.16 | v67.56,4.32 v62.48,4.32 | v86.11,26.42 v90.93,21.59 | P3.6 v82.8,26.42
  Bottom 0.305: v36.07,35.31 41.91,29.46 49.28,29.46 53.09,25.65 53.09,13.72 54.36,12.45 54.36,11.43 52.58,9.65 52.58,4.57 51.82,3.81 51.82,1.78 52.32,1.27 59.44,1.27 v62.48,4.32 | v67.56,4.32 72.39,4.32 77.72,9.65 84.84,9.65 90.68,15.49 90.68,21.34 v90.93,21.59 | v82.8,26.42 v86.11,26.42
D18  (via drill 0.3)
  Top 0.305: v39.62,42.16 40.13,42.67 40.13,45.21 IC8.21 | v29.97,45.47 29.46,45.47 25.4,49.53 22.35,49.53 v21.59,48.77
  Bottom 0.305: v39.62,42.16 38.61,42.16 37.59,43.18 32.26,43.18 v29.97,45.47 | v21.59,48.77 19.56,50.8 19.3,50.8 18.29,51.82 18.29,56.9 24.13,62.74 24.13,64.52 24.64,65.02 28.45,65.02 29.97,63.5 LCD.6
D19  (via drill 0.3)
  Top 0.305: v37.08,40.64 39.12,40.64 40.89,42.42 40.89,45.21 IC8.22 | v28.19,53.85 26.67,55.37 v26.67,55.88
  Bottom 0.305: v37.08,40.64 31.24,40.64 29.72,42.16 28.7,42.16 27.94,42.93 27.94,44.2 25.91,46.23 25.91,51.56 v28.19,53.85 | v26.67,55.88 26.67,61.72 25.15,63.25 LCD.4
D20  (via drill 0.3)
  Top 0.305: v42.67,44.7 42.67,46.99 IC8.23
  Bottom 0.305: v42.67,44.7 39.62,44.7 34.54,49.78 34.54,55.12 42.67,63.25 LCD.11
D21  (via drill 0.3)
  Top 0.305: v41.15,48.77 41.91,48.01 42.67,48.01 IC8.24 42.93,47.75 43.94,47.75 v44.96,46.74 | v48.77,42.93 50.55,41.15 50.55,40.39 IC5.14
  Bottom 0.305: v41.15,48.77 42.16,49.78 42.16,51.56 40.64,53.09 40.64,55.12 45.21,59.69 45.21,63.25 LCD.12 | v44.96,46.74 v48.77,42.93
D22  (via drill 0.3)
  Top 0.305: 44.96,48.51 45.21,48.51 v47.5,46.23 | 44.96,48.51 42.93,48.51 IC8.25 | v50.8,42.93 53.59,42.93 54.36,42.16 54.36,40.39 IC5.11 | v45.97,53.09 45.97,54.86 48.01,56.9 48.01,63.25 LCD.13 | 44.96,48.51 v44.96,48.77 | v89.41,36.32 v89.41,30.73 | v78.99,48.77 v81.53,46.23 | v60.71,52.07 58.93,50.29 v55.37,50.29
  Bottom 0.305: v50.8,42.93 v47.5,46.23 | v45.97,53.09 45.97,52.32 48.01,50.29 | 48.01,50.29 48.51,49.78 48.51,49.28 48.01,48.77 v44.96,48.77 | EXTOUT.4 74.93,14.48 73.66,13.21 73.66,12.19 75.69,10.16 84.58,10.16 90.17,15.75 90.17,26.67 89.15,27.69 89.15,30.48 v89.41,30.73 | v89.41,36.32 89.41,41.15 89.66,41.4 89.66,42.42 85.85,46.23 v81.53,46.23 | v78.99,48.77 64.01,48.77 v60.71,52.07 | 48.01,50.29 v55.37,50.29
D23  (via drill 0.3)
  Top 0.305: v44.2,49.53 42.93,49.53 IC8.26 | v46.74,49.53 47.75,50.55 48.77,50.55 49.53,51.31 v49.53,53.34 | v48.77,57.66 50.29,59.18 50.29,63.25 LCD.14
  Bottom 0.305: v46.74,49.53 v44.2,49.53 | v49.53,53.34 50.29,53.34 51.05,54.1 51.05,55.37 v48.77,57.66
D+
  Top 0.305: RD+.1 37.34,29.97 38.1,29.97 40.13,27.94 40.89,27.94 41.66,28.7 41.66,29.72 IC7.2
D-
  Top 0.305: RD-.1 34.8,29.97 35.31,29.97 37.85,27.43 41.66,27.43 42.93,28.7 42.93,29.72 IC7.3
GND  (via drill 0.3)
  Top 0.305: IC3.4 59.18,46.23 59.18,38.1 57.15,36.07 57.15,34.04 IC5.8 57.15,33.78 58.93,32 59.69,32 CAP.2 59.69,31.75 62.74,31.75 63.5,30.99 IC6.2 63.5,26.42 | 63.5,26.42 63.5,26.16 T7.1 | 63.5,26.42 V7.1 | 63.5,26.42 T7.1 | 54.86,26.16 53.34,26.16 T5.1 | V8.1 61.21,16 58.42,16 T6.1 | 58.17,22.86 54.86,26.16 | 58.17,19.05 58.17,16 T6.1 | 58.17,19.05 58.17,22.86 | 54.86,26.16 V5.1 | 58.17,19.05 53.59,19.05 51.56,17.02 V6.1 51.31,16 48.26,16 T4.1 48.01,16 48.01,22.86 44.7,26.16 | 58.17,22.86 60.2,22.86 63.25,25.91 T7.1 | 16,45.21 11.68,45.21 10.92,44.45 U1.P$1 10.92,44.2 D2.A 9.91,41.66 6.1,37.85 6.1,31.5 | 16,45.21 19.05,45.21 | 19.05,45.21 20.32,45.21 U1.GND3 | 19.05,45.21 v19.05,45.97 | 20.07,60.71 20.07,59.94 U1.GND1 | 19.56,61.21 17.53,63.25 LCD.1 | 19.56,61.21 20.07,60.71 | 19.56,61.21 19.56,58.17 | 19.56,58.17 19.56,55.88 20.07,55.37 20.83,55.37 U1.6 | 19.56,58.17 16,58.17 | 16,58.17 14.48,58.17 12.95,59.69 10.92,59.69 U1.P$2 | 20.07,60.71 24.89,60.71 27.43,63.25 LCD.5 | 16,58.17 16,45.21 | 44.7,26.16 44.45,26.16 | 44.45,26.16 43.18,26.16 T3.1 42.93,25.91 42.93,23.88 42.42,23.37 37.59,23.37 | 44.45,26.16 44.45,29.72 IC7.4 | 44.45,26.16 V3.1 44.7,26.16 | V4.1 41.15,16 38.1,16 T2.1 37.85,16 37.85,19.56 | 34.54,26.42 34.29,26.16 33.02,26.16 T1.1 32.77,26.16 32.77,27.18 28.19,31.75 | 28.19,31.75 28.19,30.99 29.46,29.72 CT.2 | 28.19,31.75 28.19,33.27 | 28.19,33.27 RB.2 | 28.19,33.27 25.15,30.23 IC1.4 | 37.85,19.56 37.85,23.11 37.59,23.37 | 34.54,26.42 37.59,23.37 | 34.54,26.42 V1.1 | 17.53,12.45 C2.- 23.62,22.1 DS.A 23.62,20.07 27.43,16.26 | 17.53,12.45 C3.- | 27.43,16.26 27.69,16 IC2.1 27.43,16.26 | 27.43,16.26 V2.1 34.54,19.56 37.85,19.56
  Top 0.305: 6.1,31.5 6.86,31.5 U$1.MTN2 6.1,31.5 | 6.1,31.5 1.52,31.5 U$1.MTN1 1.52,31.24 1.52,22.61 | 3.05,22.61 6.86,22.61 U$1.MTN4 7.11,22.61 7.11,25.15 U$1.GND | 3.05,22.61 1.52,22.61 | 1.52,22.61 U$1.MTN3 | 3.05,22.61 J0.1 7.11,13.72 C1.- 10.16,13.72 11.43,12.45 17.53,12.45 | 59.94,60.96 59.94,61.72 Q1.2 | 59.94,60.96 59.18,60.2 54.36,60.2 50.8,56.64 | 50.8,56.64 48.01,53.85 48.01,51.82 C5.2 47.75,51.82 47.24,51.31 47.24,51.05 46.74,50.55 44.96,50.55 44.45,51.05 IC8.28 40.64,51.05 38.61,49.02 | 50.8,56.64 C6.2 | IC8.6 33.53,51.05 35.05,52.58 | 35.05,52.58 37.08,54.61 IC8.39 37.08,57.66 36.83,57.91 36.83,59.18 C9.2 | C4.2 38.1,41.91 38.1,44.2 37.85,44.45 37.85,45.21 IC8.18 37.85,45.47 37.85,48.26 38.61,49.02 | 38.61,49.02 35.05,52.58 | IC6.11 74.93,29.46 74.42,28.96 74.42,25.65 76.96,23.11 76.96,22.1 78.23,20.83 P1.5 P1.6 | P1.6 P2.6 82.8,24.64 84.84,24.64 RJ1.GND | 68.58,13.72 68.58,15.75 T8.1 | 68.58,13.72 70.87,11.43 73.66,11.43 EXTOUT.3 EXTOUT.5 EXTOUT.7 82.3,10.41 | RAIN.1 82.55,10.16 82.3,10.41 | P1.6 80.77,16.26 82.3,14.73 82.3,10.41 | 94.23,50.04 P5.3 90.93,50.04 82.55,58.42 BAT1.P$1 | 94.23,50.04 95.5,48.77 98.3,48.77 B1.2 | 94.23,50.04 94.23,54.1 98.55,58.42 98.55,59.18 B0.2 | RJ1.G- 98.81,16.26 98.81,24.38 RJ1.Y- | P4.3 93.22,38.86 93.47,38.86 93.73,38.61 | 93.73,38.61 96.27,36.07 96.77,36.07 98.55,37.85 98.55,38.86 B2.2 | 69.09,41.4 69.85,40.64 69.85,40.13 | 69.09,41.4 68.58,41.91 68.58,42.67 CX1.2 | 69.85,40.13 70.61,40.13 | 70.61,40.13 71.12,40.13 IC6.21 | 69.85,40.13 IC6.22 | 70.61,40.13 71.88,41.4 72.14,41.4 72.9,42.16 72.9,42.67 CX2.2 73.15,42.67 74.93,40.89 IC6.18 74.93,36.83 75.95,35.81 82.3,35.81
  Top 0.305: 83.31,30.99 84.84,30.99 87.38,28.45 90.68,28.45 RJ1.SHIELD0 | 83.31,30.99 82.04,30.99 RBS.1 | 82.3,35.81 82.3,34.8 83.31,33.78 83.31,33.27 | 82.3,35.81 82.3,37.59 C8.1 | 83.31,30.99 83.31,33.27 | 83.31,33.27 86.61,36.58 86.61,37.59 C7.1 | v93.22,44.2 93.73,43.69 93.73,38.61 | 59.94,60.96 65.53,60.96 67.06,59.44 67.06,49.78 69.09,47.75 69.09,41.4 | 68.58,13.72 64.01,13.72 62.99,12.7 59.94,12.7 58.42,14.22 58.42,15.75 T6.1
  Bottom 0.305: v19.05,45.97 ISP.6 | 91.95,12.19 94.49,12.19 98.55,16.26 RJ1.G- | 91.95,12.19 90.93,12.19 RJ1.SHIELD1 91.95,12.19 | B2.2 98.55,38.86 97.54,38.86 90.68,32 90.68,28.45 RJ1.SHIELD0 90.93,28.45 94.49,28.45 98.55,24.38 RJ1.Y- | P5.3 91.44,48.26 93.47,46.23 93.47,44.45 v93.22,44.2 | 91.95,12.19 RAIN.1
  pour Top (isolate 0.406, hatched): 0,73.66 100.33,73.66 100.33,0 0,0
  pour Bottom (isolate 0.406): 0,73.66 100.33,73.66 100.33,0 0,0
INT0  (via drill 0.3)
  Top 0.305: v32.77,47.24 31.5,47.24 IC8.11 | v35.81,50.8 v33.78,48.77 | v41.4,54.36 v37.85,50.8 | v46.74,54.61 52.83,60.71 58.93,60.71 59.18,60.96 59.18,62.74 59.44,62.99 65.28,62.99 70.1,58.17 v70.1,42.67 | v70.87,32.77 v70.87,36.07 | v70.87,28.96 73.15,26.67 P3.3
  Bottom 0.305: v32.77,47.24 32.77,47.75 v33.78,48.77 | v37.85,50.8 v35.81,50.8 | v41.4,54.36 46.48,54.36 v46.74,54.61 | v70.1,42.67 70.87,41.91 v70.87,36.07 | v70.87,28.96 v70.87,32.77
INT1  (via drill 0.3)
  Top 0.305: v33.27,43.94 33.27,45.21 IC8.12 | v63.5,37.34 72.9,37.34 77.47,32.77 78.99,32.77 80.77,30.99 80.77,30.23 81.79,29.21 84.33,29.21 92.2,21.34 92.2,16.26 87.63,11.68 87.63,2.79 RAIN.2
  Bottom 0.305: v33.27,43.94 38.86,43.94 42.42,40.39 46.23,40.39 47.75,38.86 61.98,38.86 v63.5,37.34
INT2  (via drill 0.3)
  Top 0.305: v33.02,67.82 34.29,66.55 34.29,62.23 34.54,61.98 34.54,56.9 IC8.42 | v70.87,57.66 70.87,54.61 77.72,47.75 77.72,44.2 v77.47,43.94
  Bottom 0.305: v33.02,67.82 63.75,67.82 70.87,60.71 v70.87,57.66 | v77.47,43.94 83.31,43.94 86.61,40.64 86.61,37.08 75.95,26.42 P3.4
LEDA
  Top 0.305: R1.2 91.19,31.75 97.03,25.91 97.03,15.24 98.55,13.72 RJ1.G+
LEDB
  Top 0.305: R2.2 93.22,32.51 94.74,32.51 98.55,28.7 98.55,26.92 RJ1.Y+
MISO  (via drill 0.3)
  Top 0.305: v32.77,54.1 31.5,54.1 IC8.2 | v23.11,56.39 21.08,56.39 U1.7 | IC6.6 68.58,31.24 v66.04,33.78 | 43.94,34.54 43.18,35.31 43.18,37.34 IC7.6 | 43.94,34.54 v44.7,33.78 | v41.4,35.31 42.16,34.54 43.94,34.54
  Bottom 0.305: v23.11,56.39 25.15,56.39 26.42,55.12 28.96,55.12 29.46,55.63 31.24,55.63 v32.77,54.1 32.77,49.28 29.21,45.72 ISP.1 31.24,43.43 33.27,41.4 37.34,41.4 41.4,37.34 v41.4,35.31 | v44.7,33.78 v66.04,33.78
MOSI  (via drill 0.3)
  Top 0.305: v29.72,54.86 31.24,54.86 IC8.1 | v22.35,52.07 21.08,52.07 U1.3 | IC6.7 69.85,31.24 v66.55,34.54 | v45.21,34.54 44.45,35.31 44.45,37.34 IC7.5
  Bottom 0.305: v29.72,54.86 29.46,54.86 29.21,54.61 22.86,54.61 22.35,54.1 v22.35,52.07 22.35,47.5 25.4,44.45 25.4,42.93 26.67,41.66 | ISP.4 26.67,41.66 | v66.55,34.54 v45.21,34.54 39.62,34.54 35.05,39.12 29.21,39.12 26.67,41.66
N$1
  Bottom 0.305: D1.C 15.49,38.86 11.43,42.93 8.13,42.93 PTC.P$1
N$3  (via drill 0.3)
  Top 0.305: v45.21,28.7 47.24,28.7 RN2.1 | JP2.1 34.54,24.38 29.72,24.38 28.19,25.91 T1.3
  Bottom 0.305: v45.21,28.7 39.37,28.7 JP2.1
N$4
  Top 0.305: RN3.7 54.61,30.23 54.61,32 53.34,33.27 53.34,33.78 IC5.5
N$5
  Top 0.305: RN3.6 55.37,30.23 55.37,32.51 54.61,33.27 54.61,33.78 IC5.6
N$6  (via drill 0.3)
  Top 0.813: J2.2 2.79,39.62 5.08,37.34 v5.08,32.26
  Bottom 0.813: v5.08,32.26 5.08,30.23 5.84,29.46 5.84,15.75 3.05,12.95 J0.2
N$7
  Top 0.305: RN3.5 56.39,30.23 56.39,32.77 55.88,33.27 55.88,33.78 IC5.7
N$8  (via drill 0.3)
  Top 0.813: RSC.2 16.51,35.56 18.8,35.56 RSC1.2 | v22.1,38.1 23.11,38.1 23.62,37.59 23.62,36.58 IC1.6 | RSC.2 16.51,39.62 D2.C | v7.87,19.3 13.46,13.72 C1.+ | PTC.P$2 10.16,37.34 13.21,34.29 14.73,34.29 15.75,35.31 16.26,35.31 RSC.2
  Bottom 0.813: D2.C v22.1,38.1 | v7.87,19.3 7.87,37.08 PTC.P$2
N$10
  Top 0.305: RN3.8 53.59,30.23 53.59,31.75 52.07,33.27 52.07,33.78 IC5.4
N$11
  Top 0.305: RN2.5 50.29,30.23 50.29,33.53 50.55,33.78 IC5.3
N$12
  Top 0.305: RN2.6 49.28,30.23 49.28,33.78 IC5.2
N$13
  Top 0.305: RN2.7 48.26,30.23 48.26,33.78 IC5.1
N$14
  Top 0.305: RN2.8 47.24,30.23 47.24,37.34 49.28,39.37 49.28,40.13 IC5.15
N$15  (via drill 0.3)
  Top 0.305: v47.5,27.43 48.26,28.19 48.26,28.7 RN2.2 | v35.81,18.8 33.02,16 T2.3 33.27,15.75 JP3.1
  Bottom 0.305: v47.5,27.43 44.45,27.43 v35.81,18.8
N$16
  Top 0.813: V1.2 32.26,21.59 30.48,19.81 T1.4
  Bottom 0.813: S12.1 33.02,19.81 V1.2
N$17
  Top 0.813: V2.2 34.04,11.18 35.56,9.65 T2.4 35.81,9.4 37.85,7.37 37.85,2.79 S12.2
N$18
  Top 0.813: V3.2 42.16,21.34 40.64,19.81 T3.4
  Bottom 0.813: S34.1 43.18,19.56 V3.2
N$19  (via drill 0.3)
  Top 0.305: v49.02,27.69 49.02,28.7 RN2.3 | v42.16,24.13 40.13,24.13 38.35,25.91 T3.3
  Bottom 0.305: 45.47,24.13 45.21,23.88 JP4.1 45.47,24.13 | 45.47,24.13 v49.02,27.69 | 45.47,24.13 v42.16,24.13
N$20
  Top 0.813: V4.2 44.2,11.18 45.72,9.65 T4.4 45.97,9.4 48.01,7.37 48.01,2.79 S34.2
N$21  (via drill 0.3)
  Top 0.305: v50.04,27.69 RN2.4 | JP5.1 41.4,13.97 43.18,15.75 T4.3
  Bottom 0.305: v50.04,27.69 50.04,24.89 50.29,24.64 50.29,24.13 48.51,22.35 44.45,22.35 42.42,20.32 42.42,14.73 JP5.1
N$22
  Top 0.813: V5.2 52.32,21.34 50.8,19.81 T5.4
  Bottom 0.813: S56.1 53.34,9.14 55.12,10.92 V5.2
N$23
  Top 0.813: V6.2 54.36,11.18 55.88,9.65 T6.4 56.13,9.4 58.17,7.37 58.17,2.79 S56.2
N$24
  Top 0.813: V7.2 63.75,21.34 62.23,19.81 60.96,19.81 T7.4
  Bottom 0.813: S78.1 63.5,10.67 65.28,12.45 V7.2
N$25
  Top 0.813: V8.2 64.26,11.43 66.04,9.65 T8.4 66.29,9.91 68.58,7.62 68.58,2.79 S78.2
N$26  (via drill 0.3)
  Top 0.305: 53.09,28.19 51.82,26.92 51.82,24.64 50.8,23.62 49.28,23.62 48.51,24.38 48.51,25.91 T5.3 | 53.09,28.19 53.59,28.7 RN3.1 | 53.09,28.19 v52.83,28.45
  Bottom 0.305: JP6.1 55.12,24.89 56.13,25.91 56.13,27.18 54.86,28.45 v52.83,28.45
N$27  (via drill 0.3)
  Top 0.305: v54.61,27.69 54.61,28.7 RN3.2 | v53.85,17.53 53.85,16.26 53.59,16 T6.3 53.59,15.75 JP7.1
  Bottom 0.305: v54.61,27.69 53.85,26.92 v53.85,17.53
N$28  (via drill 0.3)
  Top 0.305: RN3.3 55.63,28.7 55.63,28.19 57.66,26.16 58.42,26.16 T7.3 58.67,25.91 v60.45,24.13
  Bottom 0.305: v60.45,24.13 65.02,24.13 JP8.1
N$29  (via drill 0.3)
  Top 0.305: v57.4,27.94 56.64,28.7 RN3.4 | JP9.1 63.5,15.75 T8.3
  Bottom 0.305: v57.4,27.94 57.4,19.3 56.64,18.54 56.64,18.03 60.71,13.97 JP9.1
N$34  (via drill 0.3)
  Top 0.305: v91.19,37.85 R1.1 | v88.39,41.91 v92.71,41.91 | v64.52,41.66 63.5,40.64 IC6.27
  Bottom 0.305: v91.19,37.85 93.47,40.13 93.47,41.15 v92.71,41.91 | v88.39,41.91 85.6,44.7 67.56,44.7 v64.52,41.66
N$36
  Top 0.305: BAT1.P$2 63.5,58.42 61.72,56.64 61.72,52.07 58.17,48.51 58.17,46.48 IC3.3
N$37  (via drill 0.3)
  Top 0.305: v93.22,38.1 R2.1 | v93.47,54.1 92.96,54.1 92.71,53.85 v88.14,53.85 | v65.28,43.43 65.28,40.64 64.77,40.13 IC6.26
  Bottom 0.305: v93.22,38.1 93.22,39.12 93.98,39.88 93.98,53.59 v93.47,54.1 | v88.14,53.85 79.5,45.21 67.06,45.21 v65.28,43.43
N$38  (via drill 0.3)
  Top 0.305: v36.07,31.75 37.34,31.75 RD+.2 | v24.89,27.43 v31.5,27.43 | v21.84,27.43 19.3,24.89 10.41,24.89 8.38,26.92 U$1.D+
  Bottom 0.305: v36.07,31.75 31.75,27.43 v31.5,27.43 | v21.84,27.43 v24.89,27.43
N$39
  Top 0.305: CAP.1 59.69,30.23 61.98,30.23 62.23,30.48 IC6.1
N$40
  Top 0.813: IC1.7 22.35,36.32 21.34,36.32 IC1.8 21.08,36.07 21.08,30.73 IC1.1 21.08,30.23 17.78,33.53 17.78,33.78 | 17.78,33.78 18.8,33.78 RSC1.1 | 17.78,33.78 16.51,33.78 RSC.1
N$41
  Top 0.305: 66.8,42.67 66.8,40.64 67.31,40.13 IC6.24 | 66.8,46.99 X2A.P$2 66.04,46.99 | 66.8,46.99 X2A1.2 | 66.8,46.99 66.8,42.67 | 66.8,42.67 CX1.1
N$42  (via drill 0.3)
  Top 0.305: v68.58,38.61 IC6.23 | v70.1,41.66 71.12,42.67 CX2.1 71.37,42.67 71.37,45.72 X2A1.1 X2A.P$1
  Bottom 0.305: v68.58,38.61 68.58,40.13 v70.1,41.66
N$45  (via drill 0.3)
  Top 0.305: RUSB.1 37.34,35.31 34.8,32.77 RD-.2 34.8,31.75 v33.27,31.75 | v19.05,25.65 15.49,25.65 13.46,27.69 7.11,27.69 U$1.D- | v30.23,22.86 v28.7,22.86
  Bottom 0.305: v19.05,25.65 20.57,25.65 23.37,22.86 v28.7,22.86 | v30.23,22.86 30.23,28.7 v33.27,31.75
N$46
  Top 0.813: IC1.2 22.61,29.97 22.61,28.96 23.62,27.94 DS.C 23.37,25.91 21.59,25.91 16.26,20.57 L3.1 L1.1
N$47
  Top 0.305: X3.1 51.56,46.48 55.37,46.48 IC3.1
N$49
  Top 0.305: CT.1 26.67,29.72 25.65,28.7 24.64,28.7 23.88,29.46 23.88,29.97 IC1.3
N$50
  Top 0.305: X3.2 53.59,44.96 55.88,44.96 56.64,45.72 56.64,46.23 IC3.2
N$52  (via drill 0.3)
  Top 0.305: SJ1.1 25.4,44.7 ISP.5 | v40.39,33.02 40.39,29.97 IC7.1
  Bottom 0.305: v40.39,33.02 35.05,38.35 29.21,38.35 27.94,39.62 26.16,39.62 25.4,40.39 25.4,42.16 ISP.5
N$54  (via drill 0.3)
  Top 0.305: RN4.6 85.09,43.43 85.85,43.43 RN4.5 86.11,43.18 v86.61,42.67 | v88.39,39.62 88.39,37.59 C7.2
  Bottom 0.305: v86.61,42.67 86.61,41.4 v88.39,39.62
N$55
  Top 0.305: 28.19,36.32 30.48,36.32 RT.2 | 28.19,36.32 25.15,36.32 IC1.5 | 28.19,36.32 RB.1
N$56
  Top 0.305: Q1.3 59.18,64.01 56.13,64.01 55.63,63.5 LCD.16
N$59  (via drill 0.3)
  Top 0.305: v79.76,33.02 82.04,33.02 RBS.2 | IC6.14 v78.74,32
  Bottom 0.305: v78.74,32 v79.76,33.02
QH*  (via drill 0.3)
  Top 0.305: v57.15,38.1 57.15,40.13 IC5.9 | v62.74,32.51 v59.18,36.07
  Bottom 0.305: v59.18,36.07 v57.15,38.1 | v62.74,32.51 62.74,30.48 66.55,26.67 66.55,18.54 66.29,18.29 66.29,17.78 68.83,15.24 EXTOUT.2
RD+  (via drill 0.3)
  Top 0.305: v85.85,40.39 RN4.4 | v77.72,32 77.72,30.99 77.47,30.73 IC6.13 77.47,29.97 78.74,28.7 83.06,28.7 84.33,27.43 84.33,27.18 86.11,25.4 86.11,20.57 87.38,19.3 RJ1.RD+
  Bottom 0.305: v85.85,40.39 85.34,40.39 85.09,40.64 84.58,40.64 83.82,39.88 83.82,36.07 83.31,35.56 81.53,35.56 80.77,36.32 80.26,36.32 77.72,33.78 v77.72,32
RD-  (via drill 0.3)
  Top 0.305: v84.84,39.88 84.84,41.91 RN4.3 | IC6.12 76.2,29.97 77.22,28.96 v77.47,28.96 79.5,26.92 79.5,25.91 80.26,25.15 v81.03,25.15
  Bottom 0.305: v84.84,39.88 84.84,36.32 v77.47,28.96 | v81.03,25.15 83.82,22.35 84.84,22.35 RJ1.RD-
RESET  (via drill 0.3)
  Top 0.305: 28.19,52.58 31.24,52.58 IC8.4 | v23.88,48.77 23.88,48.01 | 23.88,48.01 SJ1.2 | 28.19,52.58 v25.91,52.58 | 28.19,52.58 RRST.2 | IC6.10 73.66,35.56 v72.64,36.58 | v76.45,42.42 78.99,42.42 v83.57,46.99 | v66.29,66.29 v84.58,48.01 | v32.51,68.58 28.7,64.77 28.7,62.23 v24.38,57.91 | v19.05,54.86 19.05,54.61 18.8,54.36 18.8,50.04 20.83,48.01 23.88,48.01
  Bottom 0.305: v23.88,48.77 23.88,50.55 v25.91,52.58 | v72.64,36.58 72.64,38.61 v76.45,42.42 | v84.58,48.01 v83.57,46.99 | v66.29,66.29 64.01,68.58 v32.51,68.58 | v24.38,57.91 22.1,57.91 v19.05,54.86
RXD  (via drill 0.3)
  Top 0.305: v28.96,47.24 30.23,48.51 31.24,48.51 IC8.9 | v28.45,44.7 27.94,44.2 27.94,40.39 26.67,39.12 21.84,39.12 19.56,36.83 v17.53,36.83 | v18.29,21.08 20.32,21.08 22.86,23.62 v33.27,23.62 | v38.61,22.61 45.21,22.61 46.99,20.83 46.99,14.48 47.24,14.22 50.29,14.22 51.31,15.24 52.07,15.24 52.58,15.75 52.58,17.27 53.59,18.29 v57.4,18.29 | v62.48,23.37 62.99,23.37 65.02,25.4 67.06,25.4 P3.1
  Bottom 0.305: v28.96,47.24 28.96,46.23 28.45,45.72 v28.45,44.7 | v17.53,36.83 15.49,34.8 15.49,27.94 14.73,27.18 14.73,24.89 18.29,21.34 v18.29,21.08 | v33.27,23.62 34.29,22.61 v38.61,22.61 | v62.48,23.37 v57.4,18.29
SCK  (via drill 0.3)
  Top 0.305: 22.35,54.61 22.1,54.36 21.08,54.36 U1.5 | 22.35,54.61 24.38,56.64 26.92,56.64 29.97,53.59 31.24,53.59 IC8.3 31.5,53.34 v33.53,53.34 | 22.35,54.61 v23.11,53.85 | v62.74,35.31 66.8,35.31 70.61,31.5 70.61,31.24 71.12,30.73 IC6.8 | v42.42,35.31 42.42,35.81 41.91,36.32 41.91,37.34 IC7.7 41.91,37.59 41.91,38.61 42.67,39.37 v42.67,41.15
  Bottom 0.305: ISP.3 26.67,44.7 23.11,48.26 v23.11,53.85 | v42.42,35.31 v62.74,35.31 | v33.53,53.34 33.53,50.04 42.42,41.15 v42.67,41.15
SCL  (via drill 0.3)
  Top 0.305: v38.86,48.26 38.86,45.47 IC8.19 | v57.15,51.05 57.91,51.82 57.91,52.58 IC3.6 57.91,52.83 57.91,53.34 56.39,54.86 56.39,56.64 | P1.4 75.69,18.54 76.2,18.03 76.2,14.73 75.44,13.97 v72.14,13.97 | 56.39,56.64 v57.66,57.91 | 56.39,56.64 RCL.2
  Bottom 0.305: v38.86,48.26 40.64,48.26 40.89,48.01 54.1,48.01 v57.15,51.05 | v72.14,13.97 71.88,13.97 65.02,7.11 65.02,1.78 64.01,0.76 23.88,0.76 11.43,13.21 11.43,30.23 9.91,31.75 9.91,36.07 12.19,38.35 12.19,39.37 11.18,40.39 7.62,40.39 6.1,41.91 6.1,54.1 18.03,66.04 50.55,66.04 50.8,66.29 54.86,66.29 56.9,64.26 56.9,58.67 v57.66,57.91
SDA  (via drill 0.3)
  Top 0.305: v40.39,47.5 39.62,46.74 39.62,45.47 IC8.20 | 58.93,51.56 59.18,51.82 59.18,52.58 IC3.5 | 58.93,51.56 v58.42,51.05 | 58.93,51.56 58.93,55.88 | 58.93,55.88 RDA.2 | 58.93,55.88 v61.47,58.42
  Bottom 0.305: v40.39,47.5 54.86,47.5 v58.42,51.05 | P1.3 76.2,16 76.2,12.19 77.72,10.67 84.33,10.67 88.65,14.99 88.65,31.24 94.49,37.08 94.49,54.61 92.2,56.9 62.99,56.9 v61.47,58.42
TCT  (via drill 0.3)
  Top 0.305: RN4.7 84.07,43.43 83.31,43.43 RN4.8 83.06,43.18 81.03,41.15 | 81.03,41.15 80.77,40.89 80.77,37.59 C8.2 80.52,37.59 v79.5,36.58 | 81.03,41.15 83.57,38.61 84.58,38.61 L2.1
  Bottom 0.305: v79.5,36.58 76.96,34.04 76.96,29.46 74.42,26.92 74.42,25.91 71.88,23.37 71.88,22.1 73.15,20.83 80.77,20.83 81.79,19.81 84.84,19.81 RJ1.P4
TD+  (via drill 0.3)
  Top 0.305: v83.06,40.39 84.07,41.4 84.07,41.91 RN4.2 | v77.22,41.66 76.2,40.64 IC6.17 76.2,39.88 75.69,39.37 v75.69,37.08
  Bottom 0.305: v83.06,40.39 78.49,40.39 v77.22,41.66 | v75.69,37.08 75.69,34.04 71.88,30.23 71.88,25.91 69.34,23.37 69.34,22.1 71.12,20.32 78.74,20.32 79.5,19.56 79.5,18.54 82.04,16 87.38,16 RJ1.TD+
TD-  (via drill 0.3)
  Top 0.305: v82.3,41.15 83.06,41.91 RN4.1 | v78.49,41.66 77.47,40.64 IC6.16 77.47,39.62 76.45,38.61 v76.45,37.59 | v77.72,25.15 76.96,25.91 76.96,27.43 v75.44,28.96
  Bottom 0.305: v82.3,41.15 78.99,41.15 v78.49,41.66 | RJ1.TD- 84.84,18.03 86.11,19.3 86.11,20.07 85.09,21.08 84.07,21.08 80.01,25.15 v77.72,25.15 | v75.44,28.96 75.44,32 76.45,33.02 v76.45,37.59
TXD  (via drill 0.3)
  Top 0.305: v37.08,49.02 36.07,48.01 31.5,48.01 IC8.10 | v47.24,40.39 v45.72,41.91 | v68.33,28.96 70.61,26.67 P3.2
  Bottom 0.305: v37.08,49.02 38.86,47.24 38.86,46.99 39.62,46.23 44.2,46.23 45.72,44.7 v45.72,41.91 | v47.24,40.39 61.47,40.39 66.55,35.31 67.31,35.31 68.33,34.29 v68.33,28.96
VCC  (via drill 0.3)
  Top 0.305: C3.+ 24.64,10.41 25.4,9.65 IC2.4 | 37.34,37.34 40.39,37.34 IC7.8 40.64,37.59 40.64,40.13 43.18,42.67 46.23,42.67 | 36.32,38.61 36.32,38.35 37.34,37.34 | 36.32,38.61 36.32,41.91 C4.1 36.58,41.91 37.08,42.42 IC8.17 | 37.34,37.34 RUSB.2 | 36.32,38.61 v35.05,37.34 | 66.04,39.62 65.28,38.86 62.99,38.86 62.74,39.12 62.74,39.37 62.23,39.88 IC6.28 v62.23,41.66 | 66.04,39.62 IC6.25 66.04,39.88 | 66.04,39.62 67.82,37.85 70.61,37.85 71.88,39.12 71.88,39.37 72.39,39.88 IC6.20 72.39,40.13 73.66,40.13 IC6.19 v73.66,38.61 | v83.06,36.32 83.31,36.58 84.58,36.58 L2.2 | v79.76,39.62 78.99,39.62 78.74,39.88 IC6.15 | EXTOUT.1 70.61,14.48 P1.2 | 28.19,50.8 29.46,50.8 30.48,51.82 31.24,51.82 IC8.5 31.5,51.82 33.27,51.82 v35.81,54.36 | 28.19,50.8 26.67,50.8 24.38,53.09 21.08,53.09 U1.4 | 28.19,50.8 RRST.1 | C9.1 38.35,59.18 37.85,58.67 37.85,56.9 IC8.38 37.85,56.64 v37.85,53.85 | 46.23,42.67 46.23,42.42 48.26,40.39 IC5.16 | 46.23,42.67 46.23,42.93 | 46.23,42.93 ROE.2 | 46.23,42.93 46.99,43.69 | 46.99,43.69 48.26,44.96 48.26,46.48 44.45,50.29 42.93,50.29 IC8.27 42.67,50.29 v41.4,50.29 | 55.63,41.66 55.63,40.39 IC5.10 | 55.63,41.66 53.59,43.69 46.99,43.69 | 55.63,41.66 v56.39,41.66
  Bottom 0.305: C3.+ 26.16,10.41 29.46,13.72 29.46,31.75 v35.05,37.34 | v83.06,36.32 v79.76,39.62 76.71,39.62 74.68,37.59 | P1.2 70.61,20.07 P2.1 68.07,22.86 69.34,24.13 69.34,32.26 74.68,37.59 | 74.68,37.59 v73.66,38.61 | v41.4,50.29 v37.85,53.85 37.34,54.36 v35.81,54.36 | v56.39,41.66 v62.23,41.66
VIN  (via drill 0.3)
  Top 0.305: C2.+ 22.86,16 IC2.3 | 16,28.7 7.11,28.7 U$1.VBUS | 16,28.7 L1.2 | 16,28.7 L3.2 | 31.75,35.81 31.75,38.35 ISP.2 v26.67,38.35 | 31.75,35.81 31.75,35.56 31.24,35.05 30.99,35.05 30.48,34.54 RT.1 | P1.1 68.07,18.03 67.31,17.27 62.74,17.27 62.74,16 61.98,15.24 60.45,15.24 v59.44,14.22 | 31.75,35.81 v34.54,35.81 | P4.2 77.72,56.9 77.72,59.94 77.98,60.2 86.36,60.2 P5.1 | 54.36,56.64 C6.1 | 56.39,58.67 56.13,58.42 | 56.13,58.42 54.36,56.64 | 56.39,58.67 58.93,58.67 RDA.1 | 56.39,58.67 RCL.1 56.13,58.42 | 54.36,56.64 55.37,55.63 55.37,52.83 IC3.8 | v55.12,59.44 56.13,58.42
  Bottom 0.305: L1.2 16,25.91 20.07,21.84 C2.+ 20.07,12.19 18.8,10.92 18.8,9.91 19.56,9.14 25.65,9.14 29.97,13.46 29.97,21.59 32,23.62 32,26.67 36.83,31.5 36.83,33.53 v34.54,35.81 34.8,36.07 36.32,36.07 40.13,32.26 51.82,32.26 56.64,27.43 56.64,23.62 56.13,23.11 56.13,17.53 v59.44,14.22 | P5.1 84.84,55.12 83.82,56.13 63.25,56.13 62.74,55.63 58.93,55.63 v55.12,59.44 55.12,61.21 53.09,63.25 LCD.15 52.83,63.5 52.83,64.52 51.56,65.79 51.05,65.79 50.8,65.53 22.61,65.53 20.57,63.5 20.07,63.5 LCD.2 19.81,63.25 19.81,60.71 17.27,58.17 17.27,44.96 23.88,38.35 v26.67,38.35

### Text on the board
tNames: OpenSprinkler (v2.0) | Rayshobby, Nov 2012 | GND A3 VIN | 10K | GND VIN A3 | 49.9x4 | 39V | R3000 | 1.5k | 10k | 30k | 220 | 330 | 47 | 2.32k | RXD TXD INT0 INT2 D14 D15 | VCC A4 A5 A6 A7 GND | SS14 | +5V VCC SDA SCL GND GND | RJ45 | DOUT CLK LAT !OE | AC IN | 100u | VCC GND GND GND | EXTOUT | RainSense | 1 | 2 | 3 | 4 | 5 | 6 | 7 | 8
BoxDim: Serpac WM-032C Enclosure | All units are in inch | Left | Right | Front | Bottom